# Altium schematic sheet CAN.SchDoc
size A; SheetNumber: 3; SheetTotal: 9
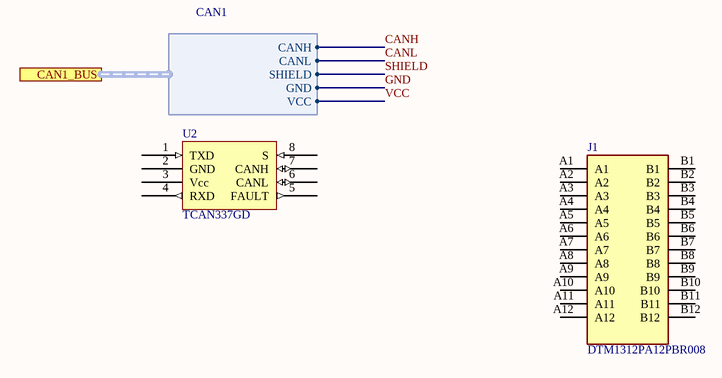
[diagram p0: CAN.SchDoc]

## Parts
J1  DTM1312PA12PBR008  [TE_DTM1312PA12PBR008]
U2  TCAN337GD  [TCAN337GD-Footprint-1]

## Ports
CAN1_BUS (harness CAN1)

## Harnesses
CAN1: CANH, CANL, SHIELD, GND, VCC

## Nets
CANH: port CAN1_BUS.CANH
CANL: port CAN1_BUS.CANL
GND: port CAN1_BUS.GND
SHIELD: port CAN1_BUS.SHIELD
VCC: port CAN1_BUS.VCC

Not connected (* = marked no-connect by the designer): J1 A1 A2 A3 A4 A5 A6 A7 A8 A9 A10 A11 A12 B1 B2 B3 B4 B5 B6 B7 B8 B9 B10 B11 B12; U2 1(TXD) 2(GND) 3(Vcc) 4(RXD) 5(FAULT) 6(CANL) 7(CANH) 8(S)

## Library data of the parts
J1 = CMP-002-00081-2: 24 way sealed A and B key PCB header with .165 inch/4.2 millimeter centerline pitch.; MP: DTM13-12PA-12PB-R008; MF: TE Connectivity; Component Type: Standard; Design Item ID: DTM1312PA12PBR008; Value: *; TE_purchase_URL: https://www.te.com/usa-en/product-DTM1312PA12PBR008.html?te_bu=Cor&te_type=disp&te_campaign=seda_glo_cor-seda-global-disp-prtnr-fy19-seda-model-bom-cta_sma-317_1&elqCampaignId=32493; Source: SnapEDAsch.SchLib; Pins: 24; Digi-Key_Part_Number: 1734-1131-ND; Case/Package: None; SnapEDA_Link: https://www.snapeda.com/parts/DTM13-12PA-12PB-R008/TE%20Connectivity%20Deutsch%20Connectors/view-part/490507/?ref=snap; Digi-Key_Purchase_URL: https://www.digikey.com/product-detail/en/te-connectivity-deutsch-connectors/DTM13-12PA-12PB-R008/1734-1131-ND/6566695?utm_source=snapeda&utm_medium=aggregator&utm_campaign=symbol
U2 = CMP-015-00008-1: 3.3-V CAN Transceivers with CAN FD (Flexible Data Rate) 8-SOIC -40 to 125 +-